# Altium schematic sheet LoadCell.SchDoc
size A
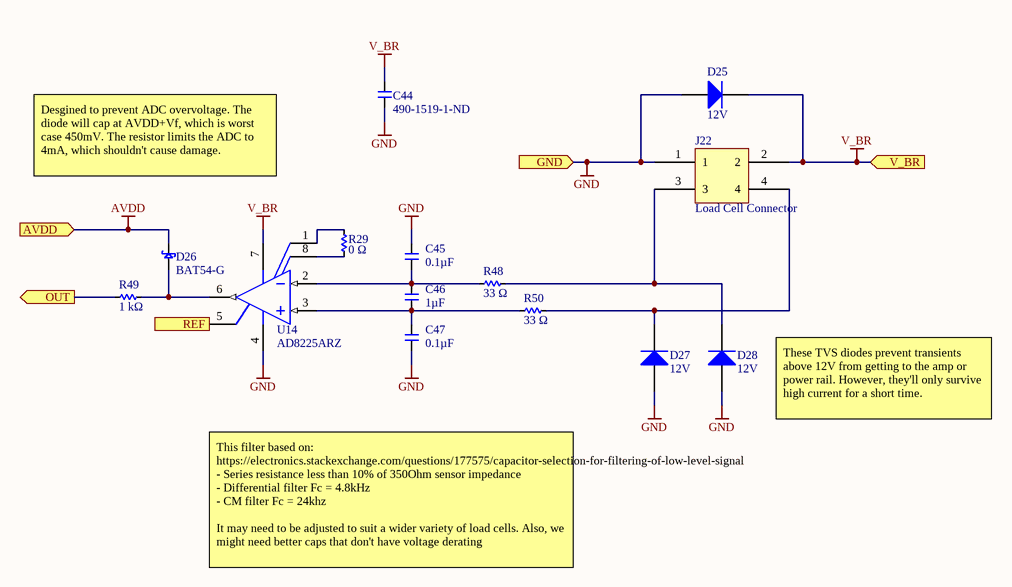
[diagram p0: LoadCell.SchDoc]

## Parts
C44  490-1519-1-ND  [C0603]
C45  Capacitance: 0.1µF  [C0603]  (hidden comment: CAP_CER_100NF_100V)
C46  Capacitance (shorthand): 1µF  [C0603]  (hidden comment: 490-3900-1-ND)
C47  Capacitance: 0.1µF  [C0603]  (hidden comment: CAP_CER_100NF_100V)
D25  Reverse Standoff Voltage: 12V  [VISH-DO-214AC-2_M]  (hidden comment: SMAJ12A-E3/61)
D26  Manufacturer Part Number: BAT54-G  [3SOT23]  (hidden comment: SCHOTTKY_BAT54-G)
D27  Reverse Standoff Voltage: 12V  [VISH-DO-214AC-2_M]  (hidden comment: SMAJ12A-E3/61)
D28  Reverse Standoff Voltage: 12V  [VISH-DO-214AC-2_M]  (hidden comment: SMAJ12A-E3/61)
J22  Load Cell Connector  [MOLEX_2x2_0430450400]
R29  Resistance: 0 Ω  [R0603]  (hidden comment: 311-0.0HRCT-ND)
R48  Resistance: 33 Ω  [R0603]  (hidden comment: 311-33.0HRCT-ND)
R49  Resistance: 1 kΩ  [R0603]  (hidden comment: 311-1.00KHRCT-ND)
R50  Resistance: 33 Ω  [R0603]  (hidden comment: 311-33.0HRCT-ND)
U14  AD8225ARZ  [ADI-R-8_N]

## Ports
AVDD (in), GND (in), OUT (out), REF (in), V_BR (in)

## Nets
AVDD: D26.3 ; port AVDD
GND: C44.2 C45.1 C47.2 D25.2(A) D27.2(A) D28.2(A) J22.1 U14.4(VS-) ; port GND
V_BR: C44.1 D25.1(K) J22.2 U14.7(VS+) ; port V_BR
OUT: R49.1 ; port OUT
REF: U14.5(REF) ; port REF
NetC45_2: C45.2 C46.1 R48.1 U14.2(IN-)
NetC46_2: C46.2 C47.1 R50.1 U14.3(IN+)
NetD26_1: D26.1 R49.2 U14.6(VOUT)
NetD27_1: D27.1(K) J22.4 R50.2
NetD28_1: D28.1(K) J22.3 R48.2
NetR29_1: R29.1 U14.8(NC)
NetR29_2: R29.2 U14.1(NC)

## Notes on the sheet
- Desgined to prevent ADC overvoltage. The diode will cap at AVDD+Vf, which is worst case 450mV. The resistor limits the ADC to 4mA, which shouldn't cause damage.
- These TVS diodes prevent transients above 12V from getting to the amp or power rail. However, they'll only survive high current for a short time.
- This filter based on:
  https://electronics.stackexchange.com/questions/177575/capacitor-selection-for-filtering-of-low-level-signal
  - Series resistance less than 10% of 350Ohm sensor impedance
  - Differential filter Fc = 4.8kHz
  - CM filter Fc = 24khz
  It may need to be adjusted to suit a wider variety of load cells. Also, we might need better caps that don't have voltage derating

## Library data of the parts
C44 = CMP-119-0065-1: CAP CER 0603 0.1µF X7R 50V 10%; Manufacturer: Murata Electronics North America; Capacitance - pF (Machine readable): #NAME?; Capacitance (shorthand): 0.1µF; Rated Voltage: 50V; Dielectric: X7R
C45 C47 = CMP-027-0018-1: CAP CER 0.1UF 100V X7S 0603; Manufacturer: TDK Corporation; Manufacturer Part Number: C1608X7S2A104K080AB; Tolerance: ±10%; Failure Rate: -; Mounting Type: Surface Mount, MLCC; Pricing 1: 1=0.19, 10=0.133, 100=0.0673, 500=0.04604, 1000=0.04073 (USD); RoHS: RoHS Compliant; ComponentLink1Description: https://product.tdk.com/info/en/catalog/datasheets/mlcc_commercial_midvoltage_en.pdf; Features: -; Design Item ID: CAP_CER_100NF_100V; Lead Spacing: -; Source: capacitor.SchLib; Packaging: Cut Tape (CT); Lead Style: -; Ratings: -; Part Status: Active; Temperature Coefficient: X7S; Operating Temperature: -55°C ~ 125°C; ComponentLink1URL: https://product.tdk.com/info/en/catalog/datasheets/mlcc_commercial_midvoltage_en.pdf; Stock 1: 662530; Size / Dimension: 0.063" L x 0.031" W (1.60mm x 0.80mm); Voltage - Rated: 100V; Applications: General Purpose; Package / Case: 0603 (1608 Metric); Thickness (Max): 0.037" (0.95mm); Height - Seated (Max): -
C46 = CMP-119-0068-1: CAP CER 0603 1µF X7R 16V 10%; Manufacturer: Murata Electronics North America; Capacitance - pF (Machine readable): #NAME?; Rated Voltage: 16V; Dielectric: X7R
D25 D27 D28 = CMP-00008-1: VISHAY - SMAJ12A-E3/61 - TVS-diod, TVS, SMAJ1 Serien, Enkelriktad, 12 V, 19.9 V, DO-214AC (SMA), 2 Stift; Current: 201A; Test Current: 1mA; Clamping Voltage: 19.9V; Min Breakdown Voltage: 13.3V; Direction: Unidirectional; Peak Pulse Power: 400W; Max Breakdown Voltage: 14.7V; Peak Pulse Current: 20.1A; Number of Channels: 1; Leakage Current: 1uA; Max Forward Surge Current (Ifsm): 40A; Element Configuration: Single; Number of Pins: 2; Min Operating Temperature: -55°C; Case/Package: SMA; Packaging: Tape and Reel; Radiation Hardening: No; Voltage Rating (DC): 12V; Height: 2.09mm; REACH SVHC: Unknown; Clamping Voltage-Max: 19.9V; Max Power Dissipation: 400W; Length: 4.5mm; Package Quantity: 1800; Operating Supply Voltage: 12V; Reverse Breakdown Voltage: 13.3V; Number of Elements: 1; Series: SMAJ; Lead Free: Lead Free; Termination: SMD/SMT; Voltage: 12V; Contact Plating: Tin,Matte; Width: 2.79mm; Power Dissipation: 400W; Polarity: Unidirectional; Max Reverse Leakage Current: 1uA; Max Surge Current: 20.1A; Max Operating Temperature: 150°C; Breakdown Voltage: 13.3V
D26 = CMP-033-0032-1: DIODE SCHOTTKY 200MA 30V SOT-23; Manufacturer: Comchip Technology; Capacitance @ Vr, F: 10pF @ 1V, 1MHz; Reverse Recovery Time (trr): 5ns; Current - Reverse Leakage @ Vr: 2mA @ 25V; Speed: Small Signal =< 200mA (Io), Any Speed; Voltage - Forward (Vf) (Max) @ If: 1V @ 100mA; Voltage - DC Reverse (Vr) (Max): 30V; Current - Average Rectified (Io): 200mA; Mounting Type: Surface Mount; ComponentLink1URL: http://comchipt.ipower.com/docs/BAT54.pdf; Diode Type: Schottky; Supplier Device Package: SOT-23-3; Stock 1: 5641; Source: diode.SchLib; Pricing 1: 1=0.35, 10=0.24, 100=0.112, 250=0.08, 500=0.0544, 1000=0.0432 (USD); RoHS: RoHS Compliant; Package / Case: TO-236-3, SC-59, SOT-23-3; ComponentLink1Description: Datasheet; Packaging: Cut Tape (CT); Design Item ID: SCHOTTKY_BAT54-G
J22 = CMP-030-0039-1: MICROFIT CONN HEADER R/A 4POS 3MM; Design Item ID: MOLEX_2x2_0430450400; Source: connector.SchLib
R29 = CMP-126-0000-2: RES SMD 0 OHM JUMPER 1/10W 0603; Manufacturer: Yageo; Manufacturer Part Number: RC0603FR-070RL; Power (Watts): 0.1W, 1/10W; Resistance (Sortable): 0; Temperature Coefficient: -; Datasheets: http://www.yageo.com/documents/recent/PYu-RC_Group_51_RoHS_L_9.pdf; Tolerance: Jumper; Image: //media.digikey.com/Renders/Yageo%20Renders/0603-(1608-Metric).jpg; Operating Temperature: -55°C ~ 155°C; Supplier 1: Mouser; Supplier Part Number 1: 667-ERJ-PB3B2492V
R48 R50 = CMP-126-0025-2: RES SMD 33 OHM 1% 1/10W 0603; Manufacturer Part Number: RC0603FR-0733RL; Manufacturer: Yageo; Power (Watts): 0.1W, 1/10W; Temperature Coefficient: ±100ppm/°C; Resistance (Sortable): 33; Tolerance: ±1%; Operating Temperature: -55°C ~ 155°C; Datasheets: http://www.yageo.com/documents/recent/PYu-RC_Group_51_RoHS_L_9.pdf; Image: //media.digikey.com/Renders/Yageo%20Renders/0603-(1608-Metric).jpg
R49 = CMP-126-0172-2: RES SMD 1K OHM 1% 1/10W 0603; Manufacturer Part Number: RC0603FR-071KL; Manufacturer: Yageo; Power (Watts): 0.1W, 1/10W; Temperature Coefficient: ±100ppm/°C; Resistance (Sortable): 1000; Tolerance: ±1%; Operating Temperature: -55°C ~ 155°C; Datasheets: http://www.yageo.com/documents/recent/PYu-RC_Group_51_RoHS_L_9.pdf; Image: //media.digikey.com/Renders/Yageo%20Renders/0603-(1608-Metric).jpg
U14 = CMP-00004-1: SP Amp INSTR Amp Single ±18V/36V 8-Pin SOIC N Tube; Max Power Dissipation: 650mW; Number of Elements: 1; Max Dual Supply Voltage: 18V; Input Offset Voltage (Vos): 50uV; Min Dual Supply Voltage: 1.7V; Common Mode Rejection Ratio: 86dB; Min Supply Voltage: 3.4V; Output Current per Channel: 18mA; Bandwidth: 900kHz; Nominal Supply Current: 1.05mA; Power Supply Rejection Ratio (PSRR): 90dB; Voltage Gain: 13.98dB; Max Supply Voltage: 36V; Operating Supply Current: 1.2mA; Slew Rate: 5V/µs; Input Bias Current: 1.2nA; Input Resistance: 10GR; Length: 5mm; Radiation Hardening: No; Number of Amplifiers: 1; Package Quantity: 98; Power Dissipation: 650mW; Lead Free: Contains Lead; Number of Circuits: 1; Min Operating Temperature: -40°C; Number of Pins: 8; Quiescent Current: 1.05mA; Contact Plating: Tin,Matte; -3db Bandwidth: 900kHz; REACH SVHC: No SVHC; Width: 4mm; Height: 1.5mm; Max Operating Temperature: 85°C; Packaging: Rail/Tube; Number of Channels: 1; Case/Package: SOIC; Max Supply Current: 1.2mA